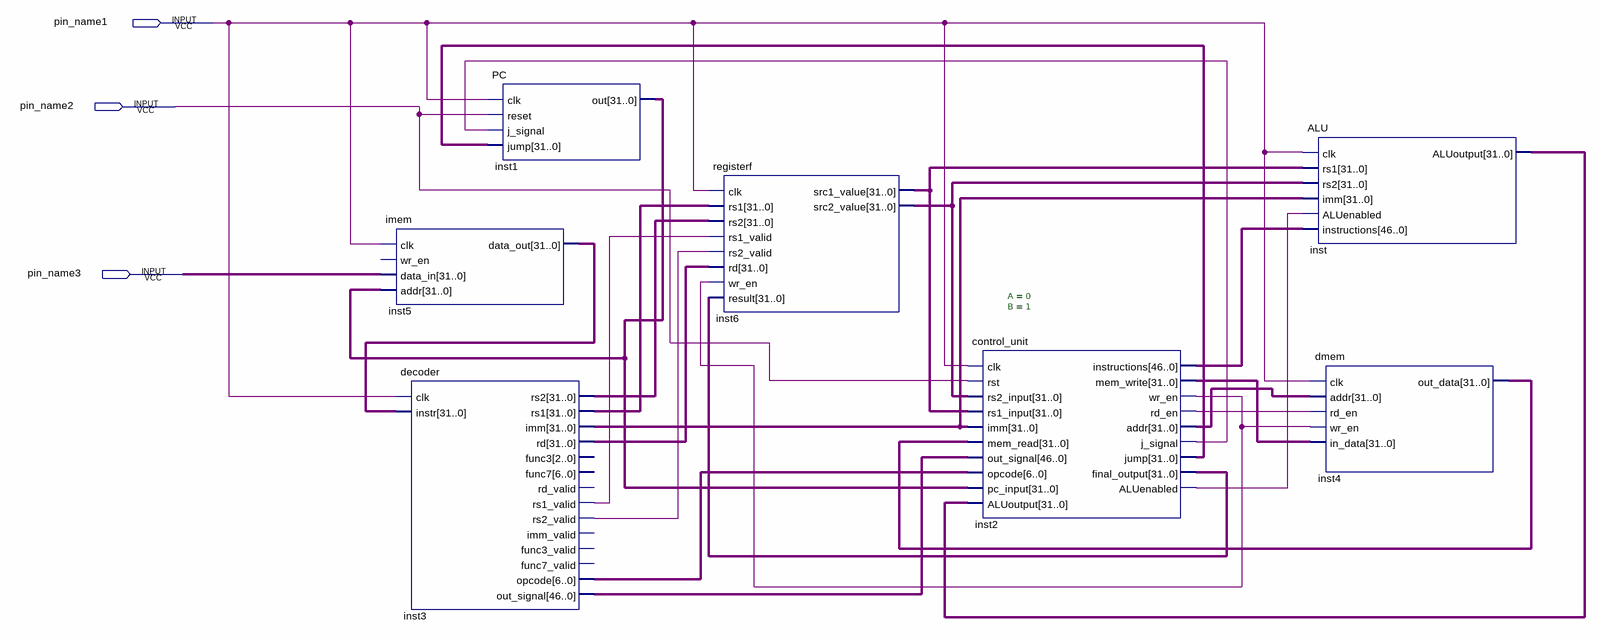
[diagram p0: schematic sheet]
// Quartus schematic RISC-V.bdf as structural Verilog: 7 symbols, 3 pins
module \RISC-V  (
  input  pin_name1,
  input  pin_name2,
  input  pin_name3
);

  wire inst2_aluenabled, inst2_j_signal, inst2_rd_en, inst2_wr_en, inst3_rs1_valid, inst3_rs2_valid;
  wire [6:0] inst3_opcode;
  wire [31:0] inst1_out, inst2_addr, inst2_final_output, inst2_jump, inst2_mem_write, inst3_imm, inst3_rd,
       inst3_rs1, inst3_rs2, inst4_out_data, inst5_data_out, inst6_src1_value, inst6_src2_value,
       inst_aluoutput, undriven;
  wire [46:0] inst2_instructions, inst3_out_signal;

  imem inst5 (.clk(pin_name1), .data_in(undriven), .addr(inst1_out), .data_out(inst5_data_out));  // open: wr_en
  decoder inst3 (
    .clk(pin_name1), .instr(inst5_data_out), .rs2(inst3_rs2), .rs1(inst3_rs1), .imm(inst3_imm),
    .rd(inst3_rd), .rs1_valid(inst3_rs1_valid), .rs2_valid(inst3_rs2_valid), .opcode(inst3_opcode),
    .out_signal(inst3_out_signal));  // open: func3, func7, rd_valid, imm_valid, func3_valid, func7_valid
  PC inst1 (.clk(pin_name1), .reset(pin_name2), .j_signal(inst2_j_signal), .jump(inst2_jump), .out(inst1_out));
  registerf inst6 (
    .clk(pin_name1), .rs1(inst3_rs1), .rs2(inst3_rs2), .rs1_valid(inst3_rs1_valid),
    .rs2_valid(inst3_rs2_valid), .rd(inst3_rd), .wr_en(inst2_wr_en), .result(inst2_final_output),
    .src1_value(inst6_src1_value), .src2_value(inst6_src2_value));
  control_unit #(.A(0), .B(1)) inst2 (
    .clk(pin_name1), .rst(pin_name2), .rs2_input(inst6_src2_value), .rs1_input(inst6_src1_value),
    .imm(inst3_imm), .mem_read(inst4_out_data), .out_signal(inst3_out_signal), .opcode(inst3_opcode),
    .pc_input(inst1_out), .ALUoutput(inst_aluoutput), .instructions(inst2_instructions),
    .mem_write(inst2_mem_write), .wr_en(inst2_wr_en), .rd_en(inst2_rd_en), .addr(inst2_addr),
    .j_signal(inst2_j_signal), .jump(inst2_jump), .final_output(inst2_final_output),
    .ALUenabled(inst2_aluenabled));
  ALU inst (
    .clk(pin_name1), .rs1(inst6_src1_value), .rs2(inst6_src2_value), .imm(inst3_imm),
    .ALUenabled(inst2_aluenabled), .instructions(inst2_instructions), .ALUoutput(inst_aluoutput));
  dmem inst4 (
    .clk(pin_name1), .addr(inst2_addr), .rd_en(inst2_rd_en), .wr_en(inst2_wr_en), .in_data(inst2_mem_write),
    .out_data(inst4_out_data));
endmodule
